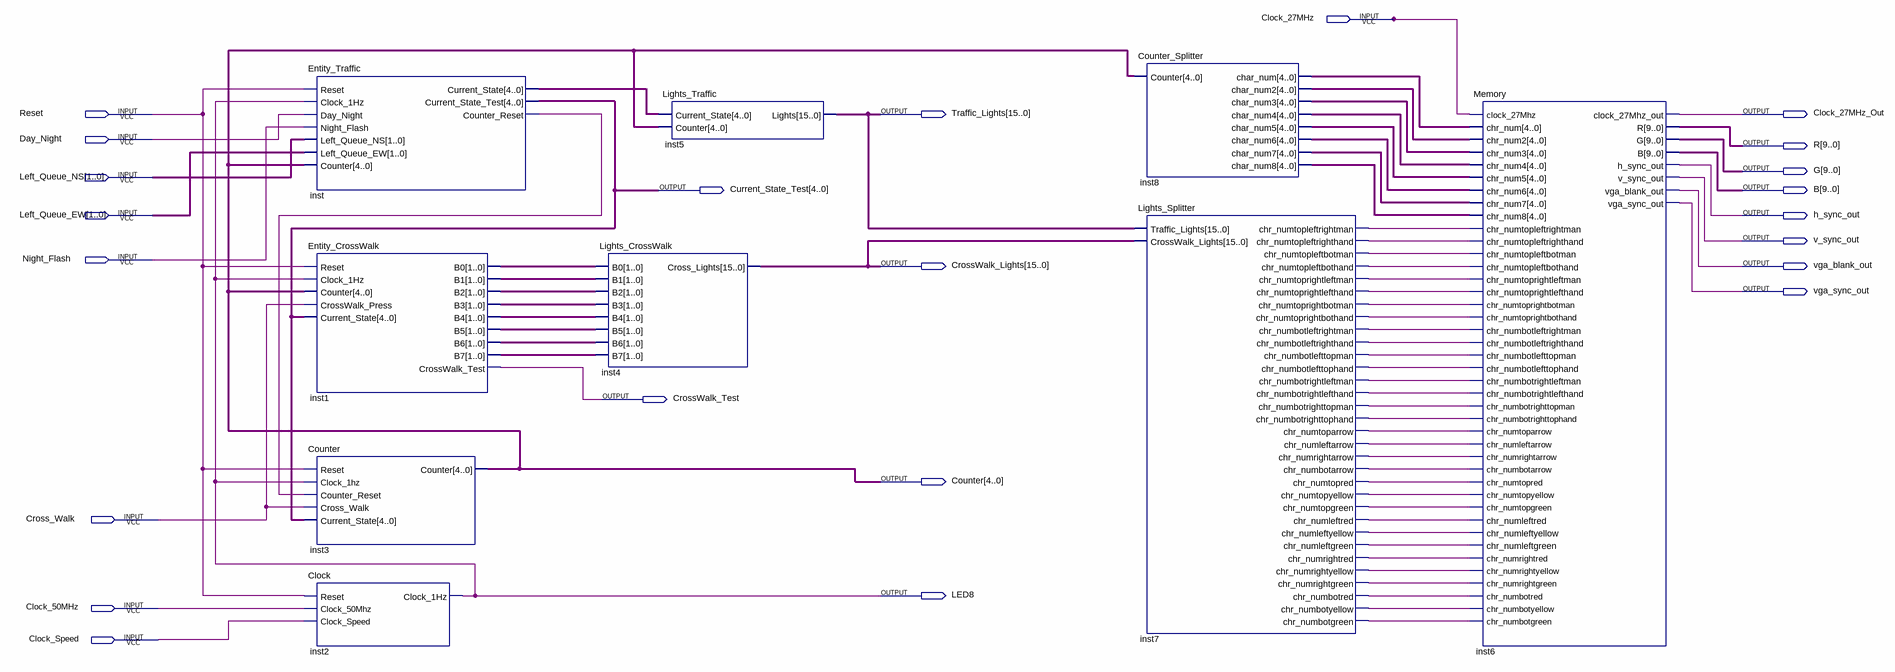
[diagram p0: schematic sheet]
// Quartus schematic TrafficLights.bdf as structural Verilog: 9 symbols, 23 pins
module TrafficLights (
  input  Clock_27MHz,
  input  Reset,
  input  Day_Night,
  input  [1:0] Left_Queue_NS,
  input  [1:0] Left_Queue_EW,
  input  Night_Flash,
  input  Cross_Walk,
  input  Clock_50MHz,
  input  Clock_Speed,
  output [15:0] Traffic_Lights,
  output Clock_27MHz_Out,
  output [9:0] R,
  output [9:0] G,
  output [4:0] Current_State_Test,
  output [9:0] B,
  output h_sync_out,
  output v_sync_out,
  output [15:0] CrossWalk_Lights,
  output vga_blank_out,
  output vga_sync_out,
  output CrossWalk_Test,
  output [4:0] Counter,
  output LED8
);

  wire inst7_chr_numbotarrow, inst7_chr_numbotgreen, inst7_chr_numbotleftrighthand,
       inst7_chr_numbotleftrightman, inst7_chr_numbotlefttophand, inst7_chr_numbotlefttopman,
       inst7_chr_numbotred, inst7_chr_numbotrightlefthand, inst7_chr_numbotrightleftman,
       inst7_chr_numbotrighttophand, inst7_chr_numbotrighttopman, inst7_chr_numbotyellow,
       inst7_chr_numleftarrow, inst7_chr_numleftgreen, inst7_chr_numleftred, inst7_chr_numleftyellow,
       inst7_chr_numrightarrow, inst7_chr_numrightgreen, inst7_chr_numrightred, inst7_chr_numrightyellow,
       inst7_chr_numtoparrow, inst7_chr_numtopgreen, inst7_chr_numtopleftbothand, inst7_chr_numtopleftbotman,
       inst7_chr_numtopleftrighthand, inst7_chr_numtopleftrightman, inst7_chr_numtopred,
       inst7_chr_numtoprightbothand, inst7_chr_numtoprightbotman, inst7_chr_numtoprightlefthand,
       inst7_chr_numtoprightleftman, inst7_chr_numtopyellow, inst_counter_reset;
  wire [1:0] inst1_b0, inst1_b1, inst1_b2, inst1_b3, inst1_b4, inst1_b5, inst1_b6, inst1_b7;
  wire [4:0] inst8_char_num, inst8_char_num2, inst8_char_num3, inst8_char_num4, inst8_char_num5,
       inst8_char_num6, inst8_char_num7, inst8_char_num8, inst_current_state;

  Entity_Traffic inst (
    .Reset(Reset), .Clock_1Hz(LED8), .Day_Night(Day_Night), .Night_Flash(Night_Flash),
    .Left_Queue_NS(Left_Queue_NS), .Left_Queue_EW(Left_Queue_EW), .Counter(Counter),
    .Current_State(inst_current_state), .Current_State_Test(Current_State_Test),
    .Counter_Reset(inst_counter_reset));
  Entity_CrossWalk inst1 (
    .Reset(Reset), .Clock_1Hz(LED8), .Counter(Counter), .CrossWalk_Press(Cross_Walk),
    .Current_State(Current_State_Test), .B0(inst1_b0), .B1(inst1_b1), .B2(inst1_b2), .B3(inst1_b3),
    .B4(inst1_b4), .B5(inst1_b5), .B6(inst1_b6), .B7(inst1_b7), .CrossWalk_Test(CrossWalk_Test));
  Counter inst3 (
    .Reset(Reset), .Clock_1hz(LED8), .Counter_Reset(inst_counter_reset), .Cross_Walk(Cross_Walk),
    .Current_State(Current_State_Test), .Counter(Counter));
  Clock inst2 (.Reset(Reset), .Clock_50Mhz(Clock_50MHz), .Clock_Speed(Clock_Speed), .Clock_1Hz(LED8));
  Lights_CrossWalk inst4 (
    .B0(inst1_b0), .B1(inst1_b1), .B2(inst1_b2), .B3(inst1_b3), .B4(inst1_b4), .B5(inst1_b5), .B6(inst1_b6),
    .B7(inst1_b7), .Cross_Lights(CrossWalk_Lights));
  Lights_Traffic inst5 (.Current_State(inst_current_state), .Counter(Counter), .Lights(Traffic_Lights));
  Counter_Splitter inst8 (
    .Counter(Counter), .char_num(inst8_char_num), .char_num2(inst8_char_num2), .char_num3(inst8_char_num3),
    .char_num4(inst8_char_num4), .char_num5(inst8_char_num5), .char_num6(inst8_char_num6),
    .char_num7(inst8_char_num7), .char_num8(inst8_char_num8));
  Lights_Splitter inst7 (
    .Traffic_Lights(Traffic_Lights), .CrossWalk_Lights(CrossWalk_Lights),
    .chr_numtopleftrightman(inst7_chr_numtopleftrightman),
    .chr_numtopleftrighthand(inst7_chr_numtopleftrighthand),
    .chr_numtopleftbotman(inst7_chr_numtopleftbotman), .chr_numtopleftbothand(inst7_chr_numtopleftbothand),
    .chr_numtoprightleftman(inst7_chr_numtoprightleftman),
    .chr_numtoprightlefthand(inst7_chr_numtoprightlefthand),
    .chr_numtoprightbotman(inst7_chr_numtoprightbotman),
    .chr_numtoprightbothand(inst7_chr_numtoprightbothand),
    .chr_numbotleftrightman(inst7_chr_numbotleftrightman),
    .chr_numbotleftrighthand(inst7_chr_numbotleftrighthand),
    .chr_numbotlefttopman(inst7_chr_numbotlefttopman), .chr_numbotlefttophand(inst7_chr_numbotlefttophand),
    .chr_numbotrightleftman(inst7_chr_numbotrightleftman),
    .chr_numbotrightlefthand(inst7_chr_numbotrightlefthand),
    .chr_numbotrighttopman(inst7_chr_numbotrighttopman),
    .chr_numbotrighttophand(inst7_chr_numbotrighttophand), .chr_numtoparrow(inst7_chr_numtoparrow),
    .chr_numleftarrow(inst7_chr_numleftarrow), .chr_numrightarrow(inst7_chr_numrightarrow),
    .chr_numbotarrow(inst7_chr_numbotarrow), .chr_numtopred(inst7_chr_numtopred),
    .chr_numtopyellow(inst7_chr_numtopyellow), .chr_numtopgreen(inst7_chr_numtopgreen),
    .chr_numleftred(inst7_chr_numleftred), .chr_numleftyellow(inst7_chr_numleftyellow),
    .chr_numleftgreen(inst7_chr_numleftgreen), .chr_numrightred(inst7_chr_numrightred),
    .chr_numrightyellow(inst7_chr_numrightyellow), .chr_numrightgreen(inst7_chr_numrightgreen),
    .chr_numbotred(inst7_chr_numbotred), .chr_numbotyellow(inst7_chr_numbotyellow),
    .chr_numbotgreen(inst7_chr_numbotgreen));
  Memory inst6 (
    .clock_27Mhz(Clock_27MHz), .chr_num(inst8_char_num), .chr_num2(inst8_char_num2),
    .chr_num3(inst8_char_num3), .chr_num4(inst8_char_num4), .chr_num5(inst8_char_num5),
    .chr_num6(inst8_char_num6), .chr_num7(inst8_char_num7), .chr_num8(inst8_char_num8),
    .chr_numtopleftrightman(inst7_chr_numtopleftrightman),
    .chr_numtopleftrighthand(inst7_chr_numtopleftrighthand),
    .chr_numtopleftbotman(inst7_chr_numtopleftbotman), .chr_numtopleftbothand(inst7_chr_numtopleftbothand),
    .chr_numtoprightleftman(inst7_chr_numtoprightleftman),
    .chr_numtoprightlefthand(inst7_chr_numtoprightlefthand),
    .chr_numtoprightbotman(inst7_chr_numtoprightbotman),
    .chr_numtoprightbothand(inst7_chr_numtoprightbothand),
    .chr_numbotleftrightman(inst7_chr_numbotleftrightman),
    .chr_numbotleftrighthand(inst7_chr_numbotleftrighthand),
    .chr_numbotlefttopman(inst7_chr_numbotlefttopman), .chr_numbotlefttophand(inst7_chr_numbotlefttophand),
    .chr_numbotrightleftman(inst7_chr_numbotrightleftman),
    .chr_numbotrightlefthand(inst7_chr_numbotrightlefthand),
    .chr_numbotrighttopman(inst7_chr_numbotrighttopman),
    .chr_numbotrighttophand(inst7_chr_numbotrighttophand), .chr_numtoparrow(inst7_chr_numtoparrow),
    .chr_numleftarrow(inst7_chr_numleftarrow), .chr_numrightarrow(inst7_chr_numrightarrow),
    .chr_numbotarrow(inst7_chr_numbotarrow), .chr_numtopred(inst7_chr_numtopred),
    .chr_numtopyellow(inst7_chr_numtopyellow), .chr_numtopgreen(inst7_chr_numtopgreen),
    .chr_numleftred(inst7_chr_numleftred), .chr_numleftyellow(inst7_chr_numleftyellow),
    .chr_numleftgreen(inst7_chr_numleftgreen), .chr_numrightred(inst7_chr_numrightred),
    .chr_numrightyellow(inst7_chr_numrightyellow), .chr_numrightgreen(inst7_chr_numrightgreen),
    .chr_numbotred(inst7_chr_numbotred), .chr_numbotyellow(inst7_chr_numbotyellow),
    .chr_numbotgreen(inst7_chr_numbotgreen), .clock_27Mhz_out(Clock_27MHz_Out), .R(R), .G(G), .B(B),
    .h_sync_out(h_sync_out), .v_sync_out(v_sync_out), .vga_blank_out(vga_blank_out),
    .vga_sync_out(vga_sync_out));
endmodule
